# Altium schematic sheet JadePlus_v0.3.1_schematics_PG1_ESP32S3.SchDoc
size A3; SheetNumber: 1; SheetTotal: 3
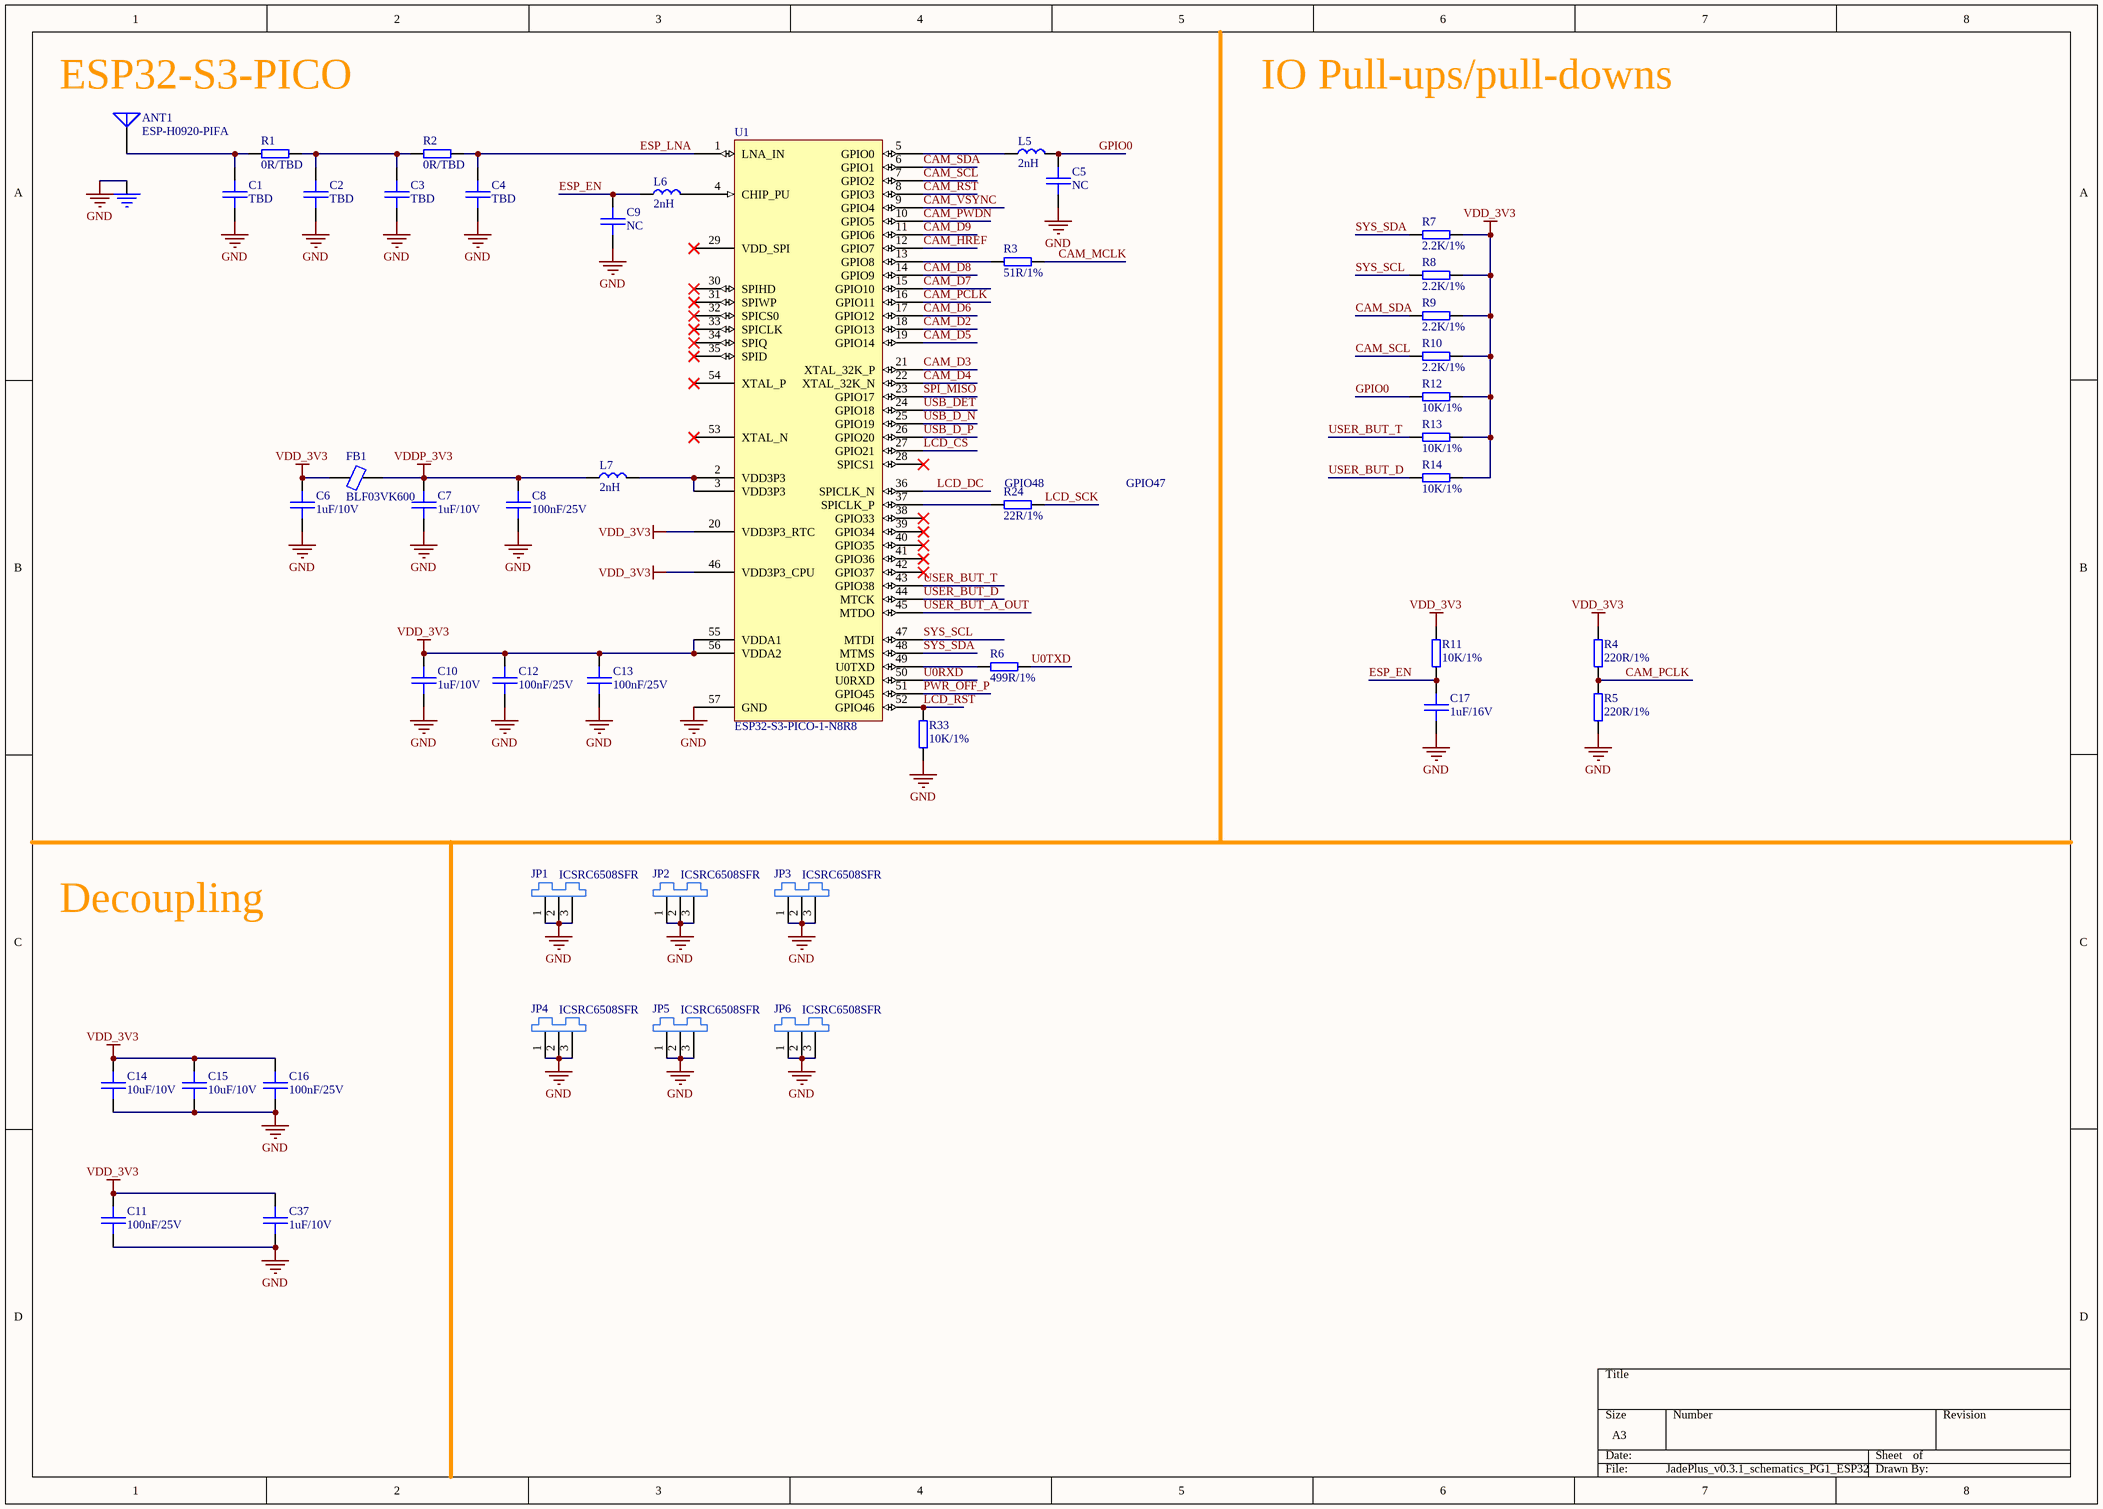
[diagram p0: JadePlus_v0.3.1_schematics_PG1_ESP32S3.SchDoc]

## Parts
ANT1  ESP-H0920-PIFA  [ESP-H0920-PIFA]
C1  TBD  [C0201-HD]
C2  TBD  [C0201-HD]
C3  TBD  [C0201-HD]
C4  TBD  [C0201-HD]
C5  NC  [C0201-HD]
C6  1uF/10V  [C0201-HD]
C7  1uF/10V  [C0201-HD]
C8  100nF/25V  [C0201-HD]
C9  NC  [C0201-HD]
C10  1uF/10V  [C0201-HD]
C11  100nF/25V  [C0201-HD]
C12  100nF/25V  [C0201-HD]
C13  100nF/25V  [C0201-HD]
C14  10uF/10V  [C0402-L-HD]
C15  10uF/10V  [C0402-L-HD]
C16  100nF/25V  [C0201-HD]
C17  1uF/16V  [C0402-HD]
C37  1uF/10V  [C0201-HD]
FB1  BLF03VK600  [L0201-HD]
JP1  ICSRC6508SFR  [SMD_3P-L6.7-W0.9-R3-P2.65-ICSRC6508SFR]
JP2  ICSRC6508SFR  [SMD_3P-L6.7-W0.9-R3-P2.65-ICSRC6508SFR]
JP3  ICSRC6508SFR  [SMD_3P-L6.7-W0.9-R3-P2.65-ICSRC6508SFR]
JP4  ICSRC6508SFR  [SMD_3P-L6.7-W0.9-R3-P2.65-ICSRC6508SFR]
JP5  ICSRC6508SFR  [SMD_3P-L6.7-W0.9-R3-P2.65-ICSRC6508SFR]
JP6  ICSRC6508SFR  [SMD_3P-L6.7-W0.9-R3-P2.65-ICSRC6508SFR]
L5  2nH  [L0201-HD]
L6  2nH  [L0201-HD]
L7  2nH  [L0201-HD]
R1  0R/TBD  [C0201-HD]
R2  0R/TBD  [C0201-HD]
R3  51R/1%  [R0402-HD]
R4  220R/1%  [R0402-HD]
R5  220R/1%  [R0402-HD]
R6  499R/1%  [R0402-HD]
R7  2.2K/1%  [R0402-HD]
R8  2.2K/1%  [R0402-HD]
R9  2.2K/1%  [R0402-HD]
R10  2.2K/1%  [R0402-HD]
R11  10K/1%  [R0402-HD]
R12  10K/1%  [R0402-HD]
R13  10K/1%  [R0402-HD]
R14  10K/1%  [R0402-HD]
R24  22R/1%  [R0402-HD]
R33  10K/1%  [R0402-HD]
U1  ESP32-S3-PICO-1-N8R8  [QFN40P700X700X90_HS-57N]

## Nets
GND: ANT1.2(G) C1.1 C2.1 C3.1 C4.1 C5.2 C6.2 C7.1 C8.2 C9.2 C10.2 C11.2 C12.2 C13.2 C14.1 C15.1 C16.2 C17.1 C37.2 JP1.1(GND) JP1.2(GND) JP1.3(GND) JP2.1(GND) JP2.2(GND) JP2.3(GND) JP3.1(GND) JP3.2(GND) JP3.3(GND) JP4.1(GND) JP4.2(GND) JP4.3(GND) JP5.1(GND) JP5.2(GND) JP5.3(GND) JP6.1(GND) JP6.2(GND) JP6.3(GND) R5.2 R33.1 U1.57(GND)
VDD_3V3: C6.1 C10.1 C11.1 C12.1 C13.1 C14.2 C15.2 C16.1 C37.1 FB1.2 R4.1 R7.2 R8.2 R9.2 R10.2 R11.1 R12.2 R13.2 R14.2 U1.20(VDD3P3_RTC) U1.46(VDD3P3_CPU) U1.55(VDDA1) U1.56(VDDA2)
VDDP_3V3: C7.2 C8.1 FB1.1 L7.2
CAM_D2: U1.18(GPIO13)
CAM_D3: U1.21(XTAL_32K_P)
CAM_D4: U1.22(XTAL_32K_N)
CAM_D5: U1.19(GPIO14)
CAM_D6: U1.17(GPIO12)
CAM_D7: U1.15(GPIO10)
CAM_D8: U1.14(GPIO9)
CAM_D9: U1.11(GPIO6)
CAM_HREF: U1.12(GPIO7)
CAM_MCLK: R3.1
CAM_PCLK: R4.2 R5.1 U1.16(GPIO11)
CAM_PWDN: U1.10(GPIO5)
CAM_RST: U1.8(GPIO3)
CAM_SCL: R10.1 U1.7(GPIO2)
CAM_SDA: R9.1 U1.6(GPIO1)
CAM_VSYNC: U1.9(GPIO4)
ESP_EN: C9.1 C17.2 L6.2 R11.2
ESP_LNA: C4.2 R2.2 U1.1(LNA_IN)
GPIO0: C5.1 L5.1 R12.1
LCD_CS: U1.27(GPIO21)
LCD_DC: U1.36(SPICLK_N)
LCD_RST: R33.2 U1.52(GPIO46)
LCD_SCK: R24.1
PWR_OFF_P: U1.51(GPIO45)
SPI_MISO: U1.23(GPIO17)
SYS_SCL: R8.1 U1.47(MTDI)
SYS_SDA: R7.1 U1.48(MTMS)
U0RXD: U1.50(U0RXD)
U0TXD: R6.1
USB_D_N: U1.25(GPIO19)
USB_D_P: U1.26(GPIO20)
USB_DET: U1.24(GPIO18)
USER_BUT_A_OUT: U1.45(MTDO)
USER_BUT_D: R14.1 U1.44(MTCK)
USER_BUT_T: R13.1 U1.43(GPIO38)
NetANT1_1: ANT1.1(A) C1.2 R1.1
NetC2_2: C2.2 C3.2 R1.2 R2.1
NetL5_2: L5.2 U1.5(GPIO0)
NetL6_1: L6.1 U1.4(CHIP_PU)
NetL7_1: L7.1 U1.2(VDD3P3) U1.3(VDD3P3)
NetR3_2: R3.2 U1.13(GPIO8)
NetR6_2: R6.2 U1.49(U0TXD)
NetR24_2: R24.2 U1.37(SPICLK_P)

Not connected (* = marked no-connect by the designer): U1 28(SPICS1)* 29(VDD_SPI)* 30(SPIHD)* 31(SPIWP)* 32(SPICS0)* 33(SPICLK)* 34(SPIQ)* 35(SPID)* 38(GPIO33)* 39(GPIO34)* 40(GPIO35)* 41(GPIO36)* 42(GPIO37)* 53(XTAL_N)* 54(XTAL_P)*

## Notes on the sheet
- (near ANT1) ESP32-S3-PICO
- IO Pull-ups/pull-downs
- (near R24) GPIO48
- GPIO47
- Decoupling

## Library data of the parts
ANT1 = Antenna_MIFA: Meandered Inverted F Antenna
C1-C17 C37 = SMT_C_0402: Surface mount capacitor 0402
FB1 = SMT_FB_0402: C1857815
L5-L7 = SMT_L_0201: Surface mount inductor 0201
R1-R14 R24 R33 = SMT_R_0402: Surface mount resistor 0402
U1 = ESP32-S3